# Altium schematic sheet ConexionesPanelFrontal.V03.R00.SchDoc: Comunicación con Panel Frontal
size A4; SheetNumber: 14; SheetTotal: 18
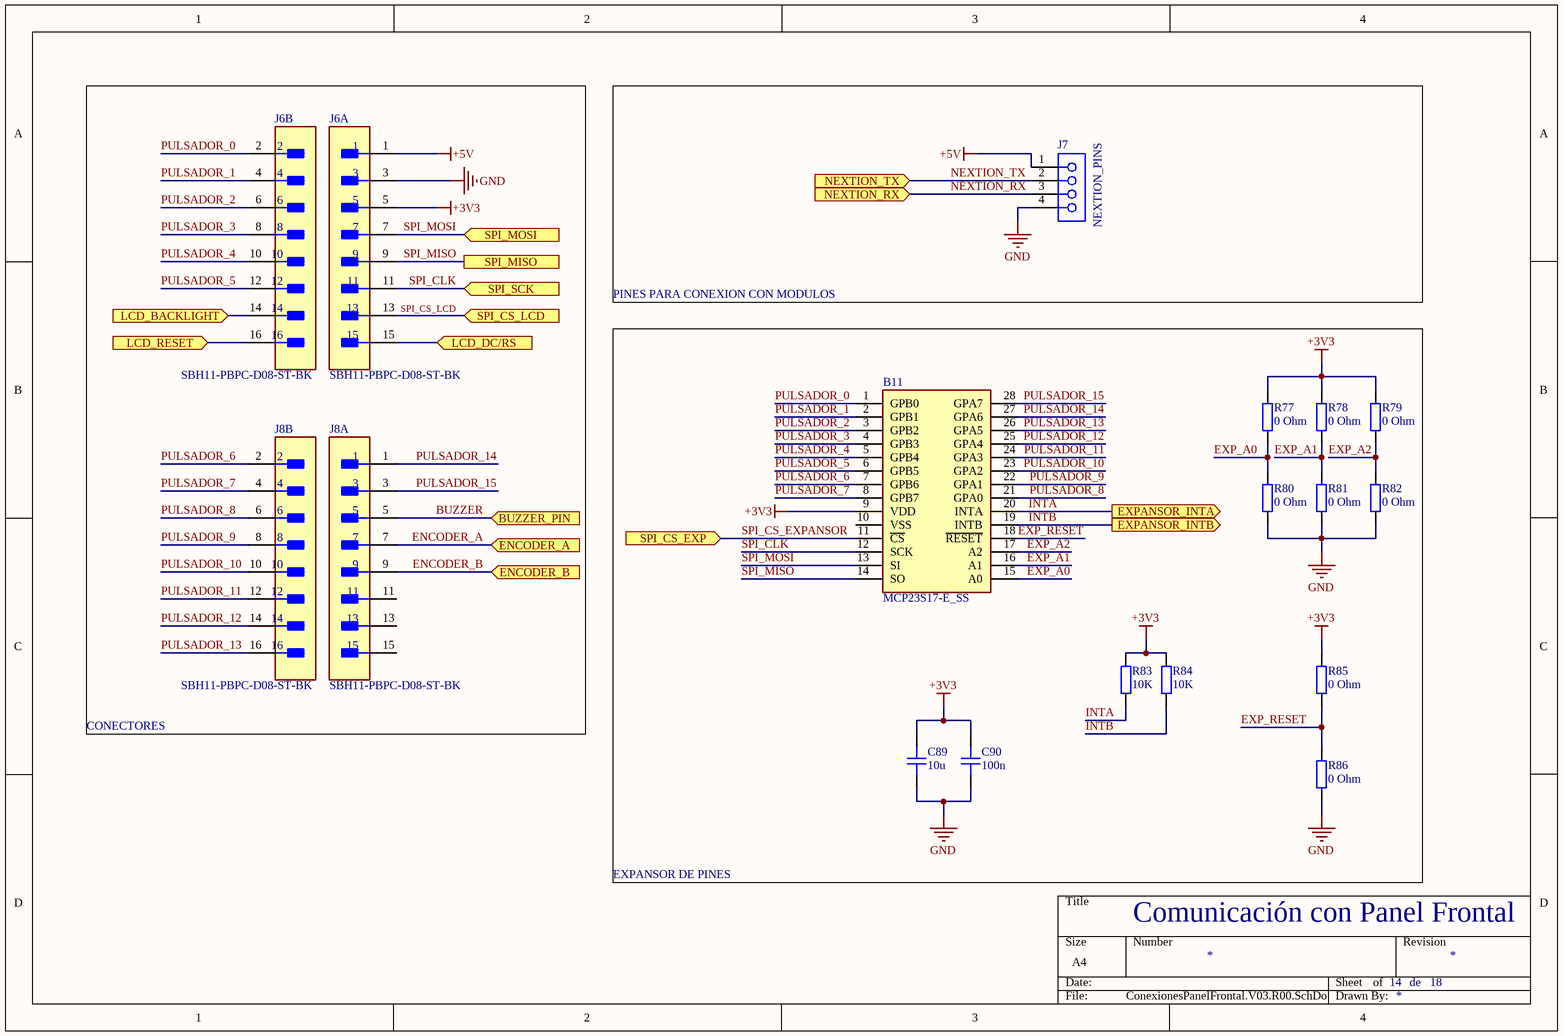
[diagram p0: ConexionesPanelFrontal.V03.R00.SchDoc]

## Parts
B11  MCP23S17-E_SS  [SOP65P780X200-28N]
C89  10u  [CAP_0805]
C90  100n  [CAP_0805]
J6  SBH11-PBPC-D08-ST-BK  [FP-SBH11-PBPC-D08-ST-BK-MFG]  (parts A,B of 2)
J7  NEXTION_PINS  [SMTC-SLW-104-01-X-S]
J8  SBH11-PBPC-D08-ST-BK  [FP-SBH11-PBPC-D08-ST-BK-MFG]  (parts A,B of 2)
R77  0 Ohm  [RES_0805]
R78  0 Ohm  [RES_0805]
R79  0 Ohm  [RES_0805]
R80  0 Ohm  [RES_0805]
R81  0 Ohm  [RES_0805]
R82  0 Ohm  [RES_0805]
R83  10K  [RES_0805]
R84  10K  [RES_0805]
R85  0 Ohm  [RES_0805]
R86  0 Ohm  [RES_0805]

## Blocks framed on the sheet
CONECTORES: J6 J8
PINES PARA CONEXION CON MODULOS: J7
EXPANSOR DE PINES: B11 C89 C90 R77-R86

## Ports
BUZZER_PIN (in), ENCODER_A (in), ENCODER_B (in), EXPANSOR_INTA (out), EXPANSOR_INTB (out), LCD_BACKLIGHT (in), LCD_DC/RS (in), LCD_RESET (in), NEXTION_RX (in), NEXTION_TX (in), SPI_CS_EXP (in), SPI_CS_LCD (in), SPI_MISO, SPI_MOSI (in), SPI_SCK (in)

## Nets
+3V3: B11.9(VDD) C89.2 C90.2 J6.5 R77.2 R78.2 R79.2 R83.2 R84.2 R85.2
+5V: J6.1 J7.1
GND: C89.1 C90.1 J6.3 J7.4 R80.1 R81.1 R82.1 R86.1
BUZZER: J8.5 ; port BUZZER_PIN
ENCODER_A: J8.7 ; port ENCODER_A
ENCODER_B: J8.9 ; port ENCODER_B
EXP_A0: B11.15(A0) R77.1 R80.2
EXP_A1: B11.16(A1) R78.1 R81.2
EXP_A2: B11.17(A2) R79.1 R82.2
EXP_RESET: B11.18(~{RESET}) R85.1 R86.2
INTA: B11.20(INTA) R83.1 ; port EXPANSOR_INTA
INTB: B11.19(INTB) R84.1 ; port EXPANSOR_INTB
LCD_BACKLIGHT: J6.14 ; port LCD_BACKLIGHT
LCD_DC/RS: J6.15 ; port LCD_DC/RS
LCD_RESET: J6.16 ; port LCD_RESET
NEXTION_RX: J7.3 ; port NEXTION_RX
NEXTION_TX: J7.2 ; port NEXTION_TX
PULSADOR_0: B11.1(GPB0) J6.2
PULSADOR_1: B11.2(GPB1) J6.4
PULSADOR_2: B11.3(GPB2) J6.6
PULSADOR_3: B11.4(GPB3) J6.8
PULSADOR_4: B11.5(GPB4) J6.10
PULSADOR_5: B11.6(GPB5) J6.12
PULSADOR_6: B11.7(GPB6) J8.2
PULSADOR_7: B11.8(GPB7) J8.4
PULSADOR_8: B11.21(GPA0) J8.6
PULSADOR_9: B11.22(GPA1) J8.8
PULSADOR_10: B11.23(GPA2) J8.10
PULSADOR_11: B11.24(GPA3) J8.12
PULSADOR_12: B11.25(GPA4) J8.14
PULSADOR_13: B11.26(GPA5) J8.16
PULSADOR_14: B11.27(GPA6) J8.1
PULSADOR_15: B11.28(GPA7) J8.3
SPI_CLK: B11.12(SCK) J6.11 ; port SPI_SCK
SPI_CS_EXPANSOR: B11.11(~{CS}) ; port SPI_CS_EXP
SPI_CS_LCD: J6.13 ; port SPI_CS_LCD
SPI_MISO: B11.14(SO) J6.9 ; port SPI_MISO
SPI_MOSI: B11.13(SI) J6.7 ; port SPI_MOSI

Not connected (* = marked no-connect by the designer): B11 10(VSS); J8 11 13 15

## Notes on the sheet
- de

## Library data of the parts
B11 = MCP23S17-E_SS: I/O Port Expander 16-Bit SPI SSOP28; Manufacturer_Name: Microchip; Manufacturer_Part_Number: MCP23S17-E/SS; Geometry.Height: 2mm; Mouser Part Number: 579-MCP23S17-E/SS; Mouser Price/Stock: https://www.mouser.co.uk/ProductDetail/Microchip-Technology/MCP23S17-E-SS?qs=usxtMOJb1RweSOLq2FO9lA%3D%3D; Datasheet Link: https://datasheet.datasheetarchive.com/originals/distributors/SFDatasheet-4/sf-00090057.pdf
C89 C90 = CAP_0805: Capacitor SMD 0805; Manufacturer: *; Manufacturer Part Number: *; Distributor Link: *; LCSC: *; Rating: *; Dielectric: *
J6 J8 = CMP-25680-000019-1: CONN HEADER VERT 16POS 2.54MM; Manufacturer: Sullins; Current Rating: 3A; Conn Gender: Male; Conn Orientation: Straight; Standoff Height: 0.3mm; Number Of Contacts: 16; Temperature: -40°C to +105°C; Digikey Description: CONN HEADER VERT 16POS 2.54MM; Contact Material: Gold,Nickel; Temperature Range High: +105°C; Package: 0; Octopart: https://octopart.com/sbh11-pbpc-d08-st-bk-sullins-12270491; Category: Conn; Automotive: No; Lead Free: Yes; ComponentLink2Description: Datasheet; Device Class L1: Connectors; Number Of Rows: 2; ComponentLink2URL: https://drawings-pdf.s3.amazonaws.com/11091.pdf; RoHS: TRUE; Height: 9.3mm; Pitch: 2.54mm; Temperature Range Low: -40°C; Device Class L2: Headers and Wire Housings; Manufacturer Part Number: SBH11-PBPC-D08-ST-BK; Device Class L3: unset
J7 = CMP-1023-00133-1: Low Profile Socket Strips, Through-hole, Vertical, -55 to 125 degC, 2.54 mm Pitch, 4-Pin, Female, RoHS; PartNumber: SLW-104-01-L-S; Manufacturer: Samtec; Pitch: 2.54 mm; Orientation: Vertical; ComponentLink1Description: Manufacturer URL; ComponentLink3Description: Package Specification; ComponentLink2URL: http://www.samtec.com/documents/webfiles/pdf/SLW.PDF; RoHS: True; ComponentLink2Description: Datasheet; ComponentLink3URL: http://www.samtec.com/documents/webfiles/cpdf/SLW-1XX-01-X-X-MKT.pdf; ComponentLink1URL: http://www.samtec.com; PackageVersion: X, 9/1987; PackageDescription: Low Profile Socket Strip; PackageReference: SLW-104-01-X-S; Mounting Technology: Through-hole; Temperature Range: -55 to 125 degC; DatasheetVersion: F-214
R77-R86 = RES_0805: Resistor SMD 0805; Manufacturer: *; Manufacturer Part Number: *; Distributor Link: *; LCSC: *